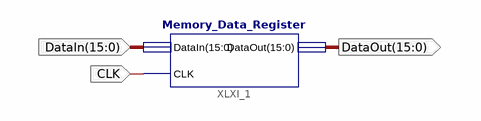
[diagram p0: schematic sheet 1]
// Xilinx ISE schematic reg16b.sch (spartan3e) as structural Verilog: 1 symbols, 3 ports
module reg16b (
  input  [15:0] DataIn,
  input  CLK,
  output [15:0] DataOut
);

  Memory_Data_Register XLXI_1 (.DataIn(DataIn), .CLK(CLK), .DataOut(DataOut));
endmodule
